# Altium project ADU.PrjPcb
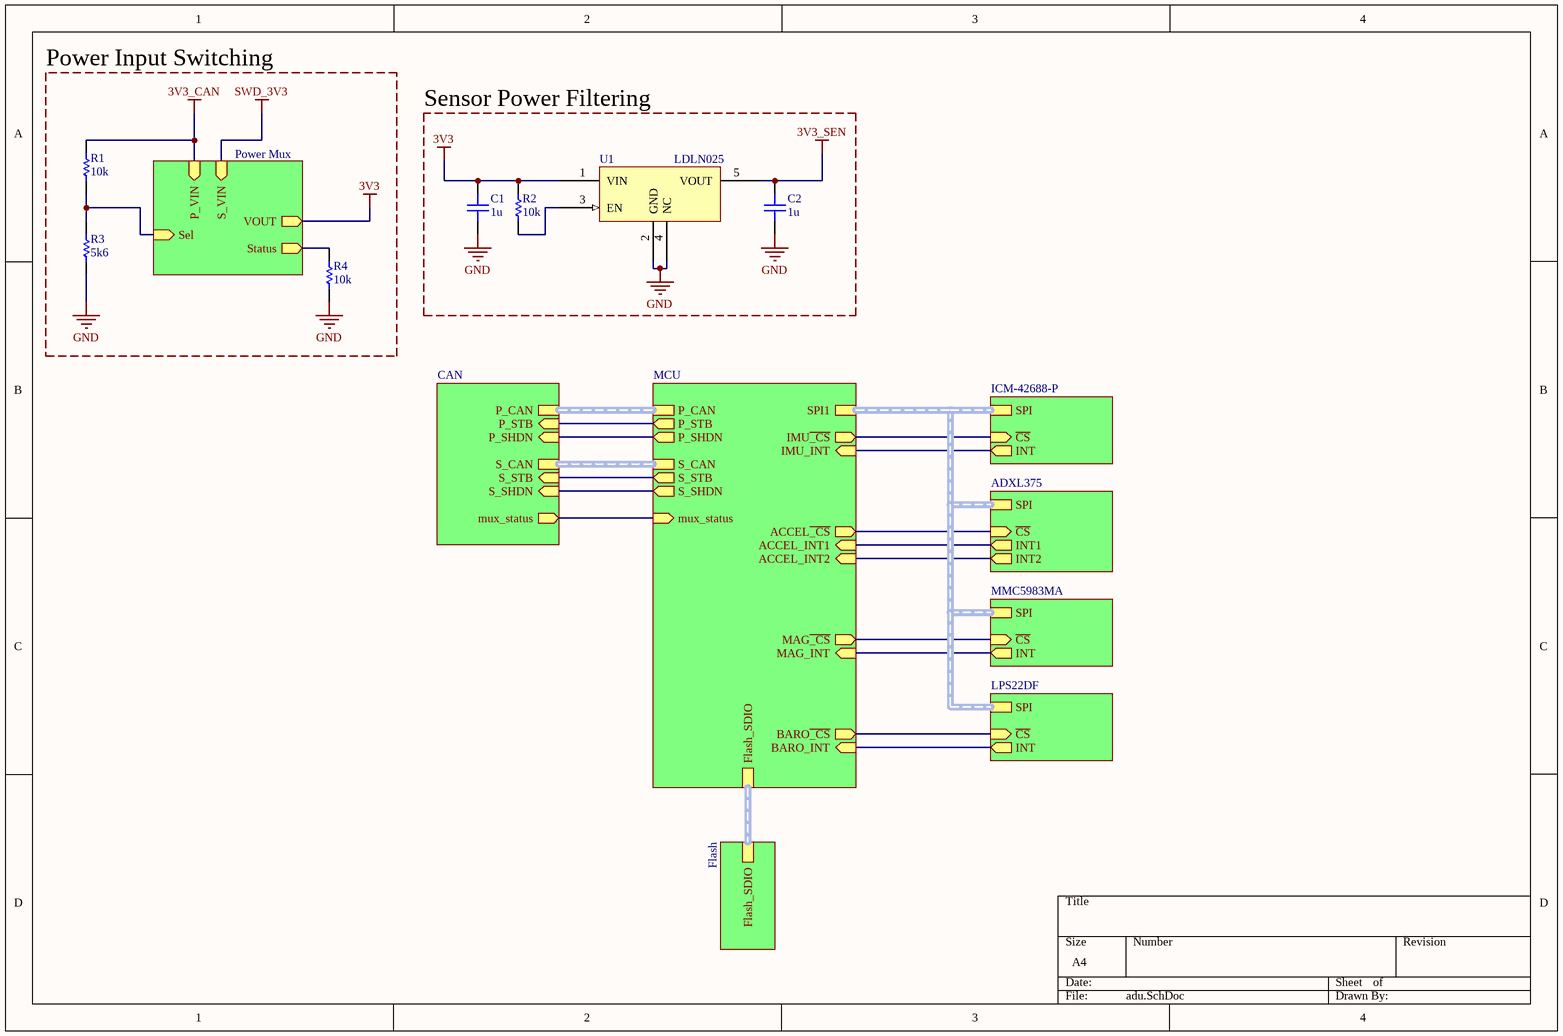
[diagram p0: adu.SchDoc]
11 sheets, 86 parts. Net scope: hierarchical (ports join the sheet entries above them; power ports are global).
Sheets:
  adu.SchDoc
    MCU = mcu.SchDoc
    CAN = CAN_bus_powered.SchDoc
      CAN Primary = CAN_transciever.SchDoc
      CAN Secondary = CAN_transciever.SchDoc
      Primary CAN Conn = dual_CAN_conn.SchDoc
      Secondary CAN Conn = dual_CAN_conn.SchDoc
      3V3_mux = power_mux.SchDoc
    Flash = flash.SchDoc
    ICM-42688-P = icm-42688-p.SchDoc
    ADXL375 = adxl375.SchDoc
    MMC5983MA = mmc5983ma.SchDoc
    LPS22DF = lps22df.SchDoc
    Power Mux = power_mux.SchDoc

## Sheet adu.SchDoc
size A4; SheetNumber: 1; SheetTotal: 11

### Parts
C1  1u  [CAP-0603-NP]
C2  1u  [CAP-0603-NP]
R1  10k  [RES-0603]
R2  10k  [RES-0603]
R3  5k6  [RES-0603]
R4  10k  [RES-0603]
U1  LDLN025  [ST SOT23-5L]

### Blocks framed on the sheet
Power Input Switching: R1 R3 R4
Sensor Power Filtering: C1 C2 R2 U1

### Sub-sheets
ADXL375 = adxl375: SPI (harness SPI), ~{CS} (in), INT1 (out), INT2 (out)
CAN = CAN_bus_powered: P_CAN (harness CAN), P_STB (in), P_SHDN (in), S_CAN (harness CAN), S_STB (in), S_SHDN (in), mux_status (out)
Flash = flash: Flash_SDIO (harness SDIO)
ICM-42688-P = icm-42688-p: SPI (harness SPI), ~{CS} (in), INT (out)
LPS22DF = lps22df: INT (out), SPI (harness SPI), ~{CS} (in)
MCU = mcu: Flash_SDIO (harness SDIO), SPI1 (harness SPI), mux_status (in), P_STB (out), P_SHDN (out), S_STB (out), S_SHDN (out), S_CAN (harness CAN), P_CAN (harness CAN), IMU~{_CS} (out), IMU_INT (in), ACCEL~{_CS} (out), ACCEL_INT2 (in), ACCEL_INT1 (in), MAG~{_CS} (out), MAG_INT (in), BARO~{_CS} (out), BARO_INT (in)
MMC5983MA = mmc5983ma: INT (out), SPI (harness SPI), ~{CS} (in)
Power Mux = power_mux: P_VIN (in), S_VIN (in), Sel (in), VOUT (out), Status (out)

### Nets
3V3: C1.2 R2.2 U1.1(VIN) ; sheet Power Mux/VOUT  [project net mux_out]
3V3_CAN: R1.2 ; sheet Power Mux/P_VIN  [project net mux_out]
3V3_SEN: C2.2 U1.5(VOUT)
GND: C1.1 C2.1 R3.1 R4.1 U1.2(GND) U1.4(NC)
mux_select: R1.1 R3.2 ; sheet Power Mux/Sel
mux_stat: R4.2 ; sheet Power Mux/Status
mux_stat: sheet MCU/mux_status, sheet CAN/mux_status  [a separate net that carries the same name]
P_CAN_SHDN: sheet MCU/P_SHDN, sheet CAN/P_SHDN
P_CAN_STB: sheet MCU/P_STB, sheet CAN/P_STB
S_CAN_SHDN: sheet MCU/S_SHDN, sheet CAN/S_SHDN
S_CAN_STB: sheet MCU/S_STB, sheet CAN/S_STB
NetR2_1: R2.1 U1.3(EN)
NetR20_1: sheet MCU/IMU~{_CS}, sheet ICM-42688-P/~{CS}
NetR21_1: sheet MCU/ACCEL~{_CS}, sheet ADXL375/~{CS}
NetR22_1: sheet MCU/MAG~{_CS}, sheet MMC5983MA/~{CS}
NetR23_1: sheet MCU/BARO~{_CS}, sheet LPS22DF/~{CS}
NetU3_17: sheet MCU/IMU_INT, sheet ICM-42688-P/INT
NetU3_24: sheet MCU/ACCEL_INT1, sheet ADXL375/INT1
NetU3_25: sheet MCU/ACCEL_INT2, sheet ADXL375/INT2
NetU3_28: sheet MCU/MAG_INT, sheet MMC5983MA/INT
NetU3_37: sheet MCU/BARO_INT, sheet LPS22DF/INT

### Buses and harness runs
harness sheet ADXL375/SPI = sheet ICM-42688-P/SPI = sheet LPS22DF/SPI = sheet MCU/SPI1 = sheet MMC5983MA/SPI
harness sheet CAN/P_CAN = sheet MCU/P_CAN
harness sheet CAN/S_CAN = sheet MCU/S_CAN
harness sheet Flash/Flash_SDIO = sheet MCU/Flash_SDIO

### Library data of the parts
C1 C2 = Capacitor
R1-R4 = Resistor
U1 = LDLN025: 250 mA ultra low noise LDO

## Sheet mcu.SchDoc
size A4; SheetNumber: 5; SheetTotal: 11
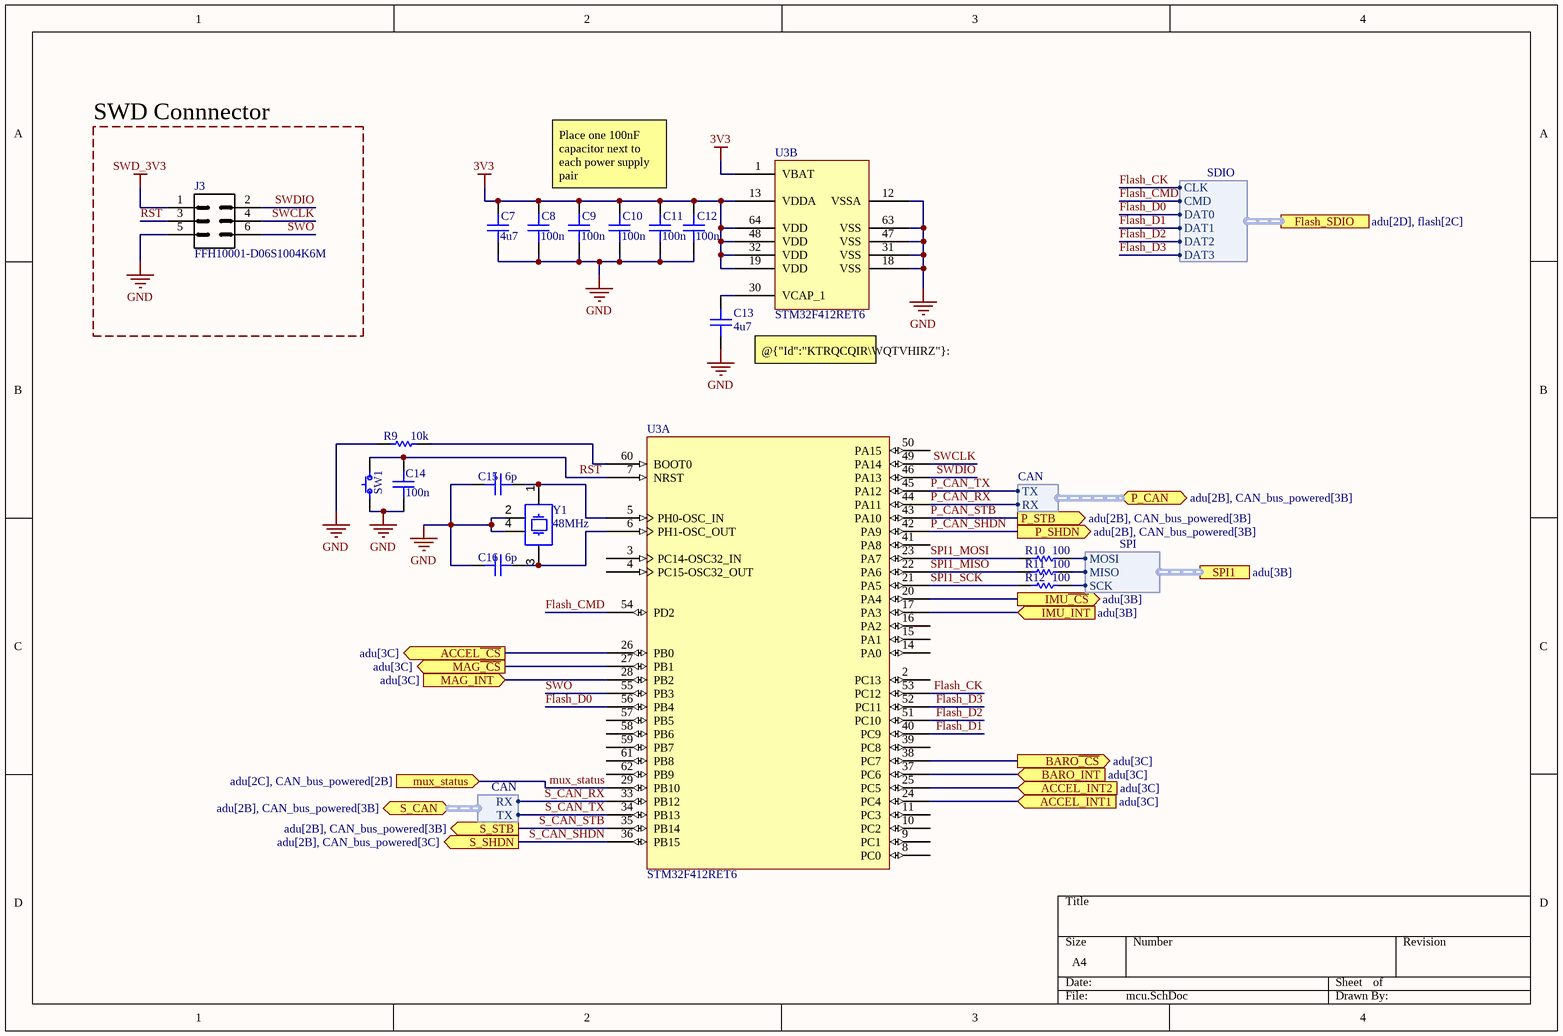
[diagram p1: mcu.SchDoc]

### Parts
C7  4u7  [CAP-0603-NP]
C8  100n  [CAP-0603-NP]
C9  100n  [CAP-0603-NP]
C10  100n  [CAP-0603-NP]
C11  100n  [CAP-0603-NP]
C12  100n  [CAP-0603-NP]
C13  4u7  [CAP-0603-NP]
C14  100n  [CAP-0603-NP]
C15  6p  [CAP-0603-NP]
C16  6p  [CAP-0603-NP]
J3  FFH10001-D06S1004K6M  [SOP127P600-8N]
R9  10k  [RES-0603]
R10  100  [RES-0603]
R11  100  [RES-0603]
R12  100  [RES-0603]
SW1  SPST Switch  [HYP 1TS026A-1000-0550-CT]  (value not drawn)
U3  STM32F412RET6  [STM32 LQFP64]  (parts A,B of 2)
Y1  48MHz  [XTAL_3.2x2.5mm]

### Blocks framed on the sheet
SWD Connnector: J3

### Ports
ACCEL_INT1 (in, see adu[3C]), ACCEL_INT2 (in, see adu[3C]), ACCEL~{_CS} (out, see adu[3C]), BARO_INT (in, see adu[3C]), BARO~{_CS} (out, see adu[3C]), Flash_SDIO (harness SDIO, see adu[2D], flash[2C]), IMU_INT (in, see adu[3B]), IMU~{_CS} (out, see adu[3B]), MAG_INT (in, see adu[3C]), MAG~{_CS} (out, see adu[3C]), mux_status (in, see adu[2C], CAN_bus_powered[2B]), P_CAN (bidir, harness CAN, see adu[2B], CAN_bus_powered[3B]), P_SHDN (out, see adu[2B], CAN_bus_powered[3B]), P_STB (out, see adu[2B], CAN_bus_powered[3B]), S_CAN (bidir, harness CAN, see adu[2B], CAN_bus_powered[3B]), S_SHDN (out, see adu[2B], CAN_bus_powered[3C]), S_STB (out, see adu[2B], CAN_bus_powered[3B]), SPI1 (harness SPI, see adu[3B])

### Harnesses
SDIO: CLK, CMD, DAT0, DAT1, DAT2, DAT3
SPI: MISO, SCK, MOSI
CAN: TX, RX

### Nets
3V3: C7.2 C8.2 C9.2 C10.2 C11.2 C12.2 U3.1(VBAT) U3.13(VDDA) U3.19(VDD) U3.32(VDD) U3.48(VDD) U3.64(VDD)  [project net mux_out]
GND: C7.1 C8.1 C9.1 C10.1 C11.1 C12.1 C13.1 C14.1 C15.1 C16.1 J3.5 R9.1 SW1.1 U3.12(VSSA) U3.18(VSS) U3.31(VSS) U3.47(VSS) U3.63(VSS) Y1.2(GND) Y1.4(GND)
SWD_3V3: J3.1  [project net secondary_VIN]
Flash_CK: U3.53(PC12) ; port Flash_SDIO.CLK
Flash_CMD: U3.54(PD2) ; port Flash_SDIO.CMD
Flash_D0: U3.56(PB4) ; port Flash_SDIO.DAT0
Flash_D1: U3.40(PC9) ; port Flash_SDIO.DAT1
Flash_D2: U3.51(PC10) ; port Flash_SDIO.DAT2
Flash_D3: U3.52(PC11) ; port Flash_SDIO.DAT3
mux_status: U3.29(PB10) ; port mux_status  [project net mux_stat]
P_CAN_RX: U3.44(PA11) ; port P_CAN.RX
P_CAN_SHDN: U3.42(PA9) ; port P_SHDN
P_CAN_STB: U3.43(PA10) ; port P_STB
P_CAN_TX: U3.45(PA12) ; port P_CAN.TX
RST: C14.2 J3.3 SW1.2 U3.7(NRST)
S_CAN_RX: U3.33(PB12) ; port S_CAN.RX
S_CAN_SHDN: U3.36(PB15) ; port S_SHDN
S_CAN_STB: U3.35(PB14) ; port S_STB
S_CAN_TX: U3.34(PB13) ; port S_CAN.TX
SPI1_MISO: R11.2 U3.22(PA6)
SPI1_MOSI: R10.2 U3.23(PA7)
SPI1_SCK: R12.2 U3.21(PA5)
SWCLK: J3.4 U3.49(PA14)
SWDIO: J3.2 U3.46(PA13)
SWO: J3.6 U3.55(PB3)
NetC13_2: C13.2 U3.30(VCAP_1)
NetC15_2: C15.2 U3.5(PH0-OSC_IN) Y1.1(X1)
NetC16_2: C16.2 U3.6(PH1-OSC_OUT) Y1.3(X2)
NetR9_2: R9.2 U3.60(BOOT0)
NetR10_1: R10.1 ; port SPI1.MOSI
NetR11_1: R11.1 ; port SPI1.MISO
NetR12_1: R12.1 ; port SPI1.SCK
NetR20_1: U3.20(PA4) ; port IMU~{_CS}
NetR21_1: U3.26(PB0) ; port ACCEL~{_CS}
NetR22_1: U3.27(PB1) ; port MAG~{_CS}
NetR23_1: U3.38(PC7) ; port BARO~{_CS}
NetU3_17: U3.17(PA3) ; port IMU_INT
NetU3_24: U3.24(PC4) ; port ACCEL_INT1
NetU3_25: U3.25(PC5) ; port ACCEL_INT2
NetU3_28: U3.28(PB2) ; port MAG_INT
NetU3_37: U3.37(PC6) ; port BARO_INT

Not connected (* = marked no-connect by the designer): U3 2(PC13) 3(PC14-OSC32_IN) 4(PC15-OSC32_OUT) 8(PC0) 9(PC1) 10(PC2) 11(PC3) 14(PA0) 15(PA1) 16(PA2) 39(PC8) 41(PA8) 50(PA15) 57(PB5) 58(PB6) 59(PB7) 61(PB8) 62(PB9)

### Notes on the sheet
- Place one 100nF capacitor next to each power supply pair
- @{"Id":"KTRQCQIR\WQTVHIRZ"}: ESR < 1 Ohm

### Library data of the parts
C7-C16 = Capacitor
J3 = Connector 6-Pin 2 Row
R9-R12 = Resistor
SW1 = SW_SPST: HYP (Hongyuan Precision) 1TS026A-1000-0550-CT
U3 = STM32F412RET6: 512KB 1.7V~3.6V ARM Cortex-M4 256KB 100MHz FLASH 50 LQFP-64(10x10) Microcontroller Units (MCUs/MPUs/SOCs) ROHS
Y1 = XTAL-4Pin: HCI XC32M4-48.000-F08NLDT / 8pF load capacitance

## Sheet CAN_bus_powered.SchDoc
size A4; SheetNumber: 2; SheetTotal: 11
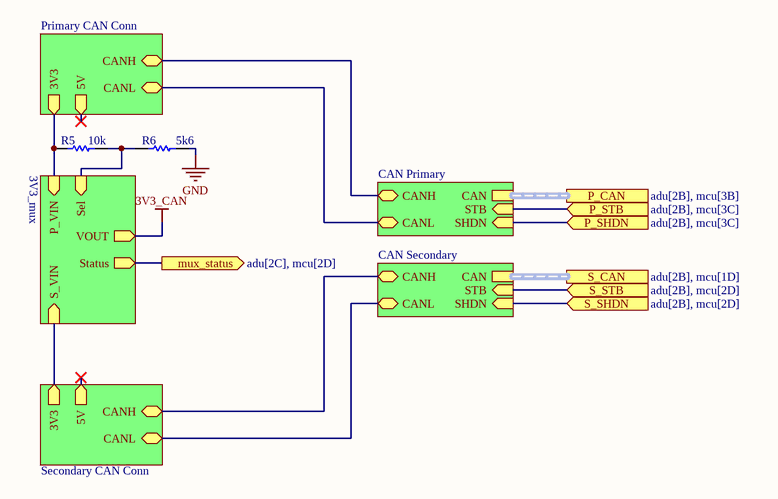
[diagram p2: CAN_bus_powered.SchDoc]

### Parts
R5  10k  [RES-0603]
R6  5k6  [RES-0603]

### Sub-sheets
3V3_mux = power_mux: P_VIN (in), S_VIN (in), Sel (in), VOUT (out), Status (out)
CAN Primary = CAN_transciever: CAN (harness CAN), STB (in), SHDN (in), CANH (bidir), CANL (bidir)
CAN Secondary = CAN_transciever: CAN (harness CAN), STB (in), SHDN (in), CANH (bidir), CANL (bidir)
Primary CAN Conn = dual_CAN_conn: 5V (out), 3V3 (out), CANH (bidir), CANL (bidir)
Secondary CAN Conn = dual_CAN_conn: 5V (out), 3V3 (out), CANH (bidir), CANL (bidir)

### Ports
mux_status (out, see adu[2C], mcu[2D]), P_CAN (harness CAN, see adu[2B], mcu[3B]), P_SHDN (in, see adu[2B], mcu[3C]), P_STB (in, see adu[2B], mcu[3C]), S_CAN (harness CAN, see adu[2B], mcu[1D]), S_SHDN (in, see adu[2B], mcu[2D]), S_STB (in, see adu[2B], mcu[2D])

### Nets
GND: R6.1
CAN_N: sheet CAN Primary/CANL, sheet Primary CAN Conn/CANL
CAN_N: sheet CAN Secondary/CANL, sheet Secondary CAN Conn/CANL  [a separate net that carries the same name]
CAN_P: sheet CAN Primary/CANH, sheet Primary CAN Conn/CANH
CAN_P: sheet CAN Secondary/CANH, sheet Secondary CAN Conn/CANH  [a separate net that carries the same name]
mux_select: R5.1 R6.2 ; sheet 3V3_mux/Sel
mux_stat: port mux_status, sheet 3V3_mux/Status
P_CAN_SHDN: port P_SHDN, sheet CAN Primary/SHDN
P_CAN_STB: port P_STB, sheet CAN Primary/STB
primary_VIN: R5.2 ; sheet Primary CAN Conn/3V3, sheet 3V3_mux/P_VIN
S_CAN_SHDN: port S_SHDN, sheet CAN Secondary/SHDN
S_CAN_STB: port S_STB, sheet CAN Secondary/STB
secondary_VIN: sheet Secondary CAN Conn/3V3, sheet 3V3_mux/S_VIN

### Buses and harness runs
harness port P_CAN = sheet CAN Primary/CAN
harness port S_CAN = sheet CAN Secondary/CAN

### Library data of the parts
R5 R6 = Resistor

## Sheet CAN_transciever.SchDoc
size A4; SheetNumber: 3; SheetTotal: 11
Used 2 times, as channels CAN/CAN Primary, CAN/CAN Secondary. Parts and nets are listed once, with the designators drawn on the sheet.
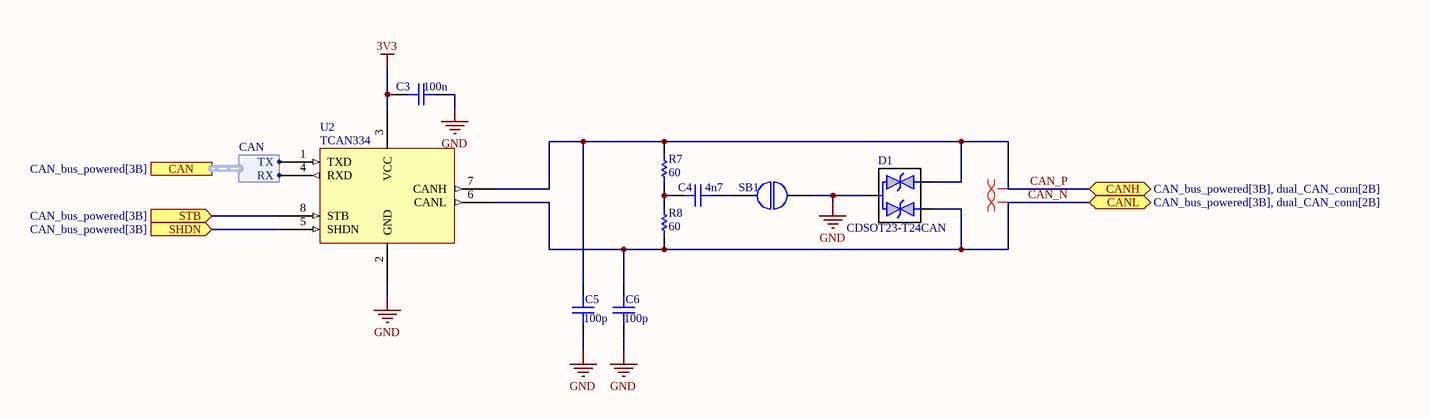
[diagram p3: CAN_transciever.SchDoc]

### Parts
C3  100n  [CAP-0603-NP]
C4  4n7  [CAP-0603-NP]
C5  100p  [CAP-0603-NP]
C6  100p  [CAP-0603-NP]
D1  CDSOT23-T24CAN  [SOT23127P600-8N]
R7  60  [RES-0603]
R8  60  [RES-0603]
SB1  NO Solder Bridge  [Solder Bridge]  (value not drawn)
U2  TCAN334  [ST SOT23-5L]

### Ports
CAN (harness CAN, see CAN_bus_powered[3B]), CANH (bidir, see CAN_bus_powered[3B], dual_CAN_conn[2B]), CANL (bidir, see CAN_bus_powered[3B], dual_CAN_conn[2B]), SHDN (in, see CAN_bus_powered[3B]), STB (in, see CAN_bus_powered[3B])

### Harnesses
CAN: TX, RX

### Nets
3V3: C3.2 U2.3(VCC)
GND: C3.1 C5.2 C6.2 D1.3 SB1.1 U2.2(GND)
CAN_N: C6.1 D1.1 R8.2 U2.6(CANL) ; port CANL
CAN_P: C5.1 D1.2 R7.1 U2.7(CANH) ; port CANH
SHDN: U2.5(SHDN) ; port SHDN
STB: U2.8(STB) ; port STB
NetC4_1: C4.1 SB1.2
NetC4_2: C4.2 R7.2 R8.1
NetU2_1: U2.1(TXD) ; port CAN.TX
NetU2_4: U2.4(RXD) ; port CAN.RX

### Channels
CAN/CAN Primary: designators end in _CAN_Primary; ports CANH=CAN_P CANL=CAN_N SHDN=P_CAN_SHDN STB=P_CAN_STB
CAN/CAN Secondary: designators end in _CAN_Secondary; ports CANH=CAN_P CANL=CAN_N SHDN=S_CAN_SHDN STB=S_CAN_STB

### Layout directives
differential pair: CAN_N, CAN_P

### Library data of the parts
C3-C6 = Capacitor
D1 = Dual TVS Diode
R7 R8 = Resistor
SB1 = NO Solder Bridge: Normally Open Solder Bridge
U2 = TCAN334: Can tranciever with shutdown and standby with wake

## Sheet dual_CAN_conn.SchDoc
size A4; SheetNumber: 4; SheetTotal: 11
Used 2 times, as channels CAN/Primary CAN Conn, CAN/Secondary CAN Conn. Parts and nets are listed once, with the designators drawn on the sheet.
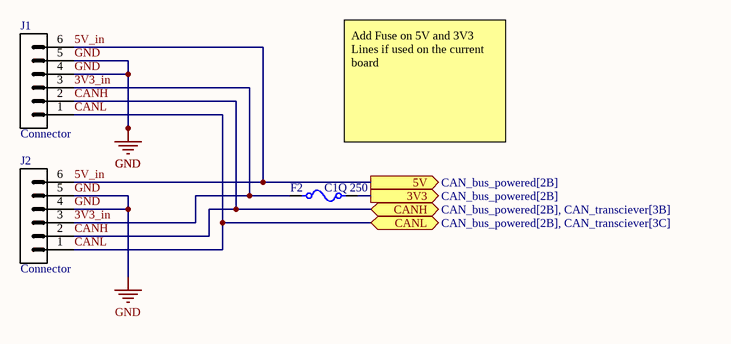
[diagram p4: dual_CAN_conn.SchDoc]

### Parts
F2  C1Q 250  [Chip2PinSM127P600-8N]
J1  Connector  [HRS_DF58-6P-1.2V(21)]
J2  Connector  [HRS_DF58-6P-1.2V(21)]

### Ports
3V3 (out, see CAN_bus_powered[2B]), 5V (out, see CAN_bus_powered[2B]), CANH (bidir, see CAN_bus_powered[2B], CAN_transciever[3B]), CANL (bidir, see CAN_bus_powered[2B], CAN_transciever[3C])

### Nets
GND: J1.4 J1.5 J2.4 J2.5
3V3: F2.2 ; port 3V3
3V3_in: F2.1 J1.3 J2.3
5V_in: J1.6 J2.6 ; port 5V
CANH: J1.2 J2.2 ; port CANH
CANL: J1.1 J2.1 ; port CANL

### Channels
CAN/Primary CAN Conn: designators end in _Primary_CAN_Conn; ports 3V3=primary_VIN 5V=5V_in_Primary CAN Conn CANH=CAN_P CANL=CAN_N
CAN/Secondary CAN Conn: designators end in _Secondary_CAN_Conn; ports 3V3=secondary_VIN 5V=5V_in_Secondary CAN Conn CANH=CAN_P CANL=CAN_N

### Notes on the sheet
- Add Fuse on 5V and 3V3 Lines if used on the current board

### Library data of the parts
F2 = Fuse
J1 J2 = Connector 6-Pin 1 Row: 6 Pin 1 Row Connector

## Sheet power_mux.SchDoc
size A4; SheetNumber: 6; SheetTotal: 11
Used 2 times, as channels CAN/3V3_mux, Power Mux. Parts and nets are listed once, with the designators drawn on the sheet.
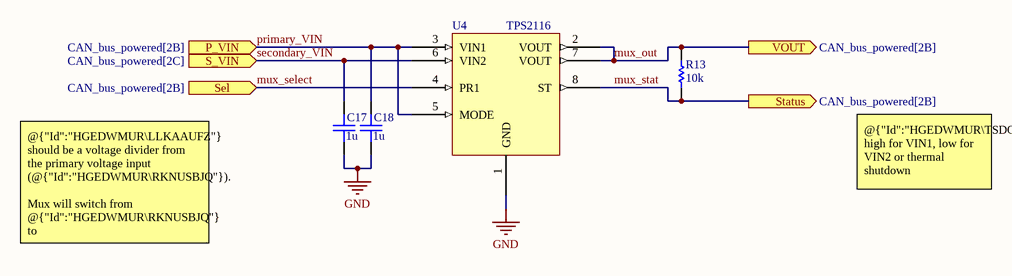
[diagram p5: power_mux.SchDoc]

### Parts
C17  1u  [CAP-0603-NP]
C18  1u  [CAP-0603-NP]
R13  10k  [RES-0603]
U4  TPS2116  [SOT-5x3]

### Ports
P_VIN (in, see CAN_bus_powered[2B]), S_VIN (in, see CAN_bus_powered[2C]), Sel (in, see CAN_bus_powered[2B]), Status (out, see CAN_bus_powered[2B]), VOUT (out, see CAN_bus_powered[2B])

### Nets
GND: C17.1 C18.1 U4.1(GND)
mux_out: R13.2 U4.2(VOUT) U4.7(VOUT) ; port VOUT
mux_select: U4.4(PR1) ; port Sel
mux_stat: R13.1 U4.8(ST) ; port Status
primary_VIN: C18.2 U4.3(VIN1) U4.5(MODE) ; port P_VIN
secondary_VIN: C17.2 U4.6(VIN2) ; port S_VIN

### Channels
CAN/3V3_mux: designators end in _3V3_mux; ports P_VIN=primary_VIN S_VIN=secondary_VIN Sel=mux_select Status=mux_stat VOUT=mux_out
Power Mux: designators end in _Power_Mux; ports P_VIN=mux_out S_VIN=secondary_VIN Sel=mux_select Status=mux_stat VOUT=mux_out

### Notes on the sheet
- @{"Id":"HGEDWMUR\TSDOJRFR"}: high for VIN1, low for VIN2 or thermal shutdown
- @{"Id":"HGEDWMUR\LLKAAUFZ"} should be a voltage divider from the primary voltage input (@{"Id":"HGEDWMUR\RKNUSBJQ"}).
  Mux will switch from @{"Id":"HGEDWMUR\RKNUSBJQ"} to @{"Id":"HGEDWMUR\STDIKBVV"} when the voltage at sel is less than 1V.

### Library data of the parts
C17 C18 = Capacitor
R13 = Resistor
U4 = TPS2116: 1.6 V to 5.5 V, 2.5-A Low IQ Power Mux with Manual and Priority Switchover

## Sheet flash.SchDoc
size A4; SheetNumber: 7; SheetTotal: 11
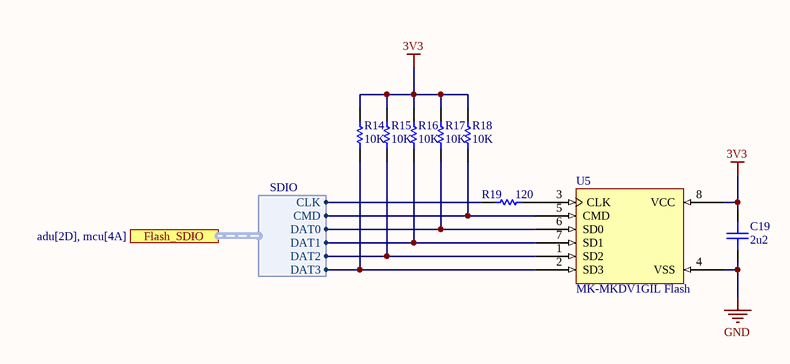
[diagram p6: flash.SchDoc]

### Parts
C19  2u2  [CAP-0603-NP]
R14  10K  [RES-0603]
R15  10K  [RES-0603]
R16  10K  [RES-0603]
R17  10K  [RES-0603]
R18  10K  [RES-0603]
R19  120  [RES-0603]
U5  MK-MKDV1GIL Flash  [QFN127P800X600X75-8N]

### Ports
Flash_SDIO (harness SDIO, see adu[2D], mcu[4A])

### Harnesses
SDIO: CLK, CMD, DAT0, DAT1, DAT2, DAT3

### Nets
3V3: C19.2 R14.2 R15.2 R16.2 R17.2 R18.2 U5.8(VCC)  [project net mux_out]
GND: C19.1 U5.4(VSS)
Flash_CK: R19.2 ; port Flash_SDIO.CLK
Flash_CMD: R18.1 U5.5(CMD) ; port Flash_SDIO.CMD
Flash_D0: R17.1 U5.6(SD0) ; port Flash_SDIO.DAT0
Flash_D1: R16.1 U5.7(SD1) ; port Flash_SDIO.DAT1
Flash_D2: R15.1 U5.1(SD2) ; port Flash_SDIO.DAT2
Flash_D3: R14.1 U5.2(SD3) ; port Flash_SDIO.DAT3
NetR19_1: R19.1 U5.3(CLK)

### Library data of the parts
C19 = Capacitor
R14-R19 = Resistor
U5 = MK-MKDV1GIL: 1Gbit LGA-8(6x8) SD NAND FLASH ROHS

## Sheet icm-42688-p.SchDoc
size A4; SheetNumber: 8; SheetTotal: 11
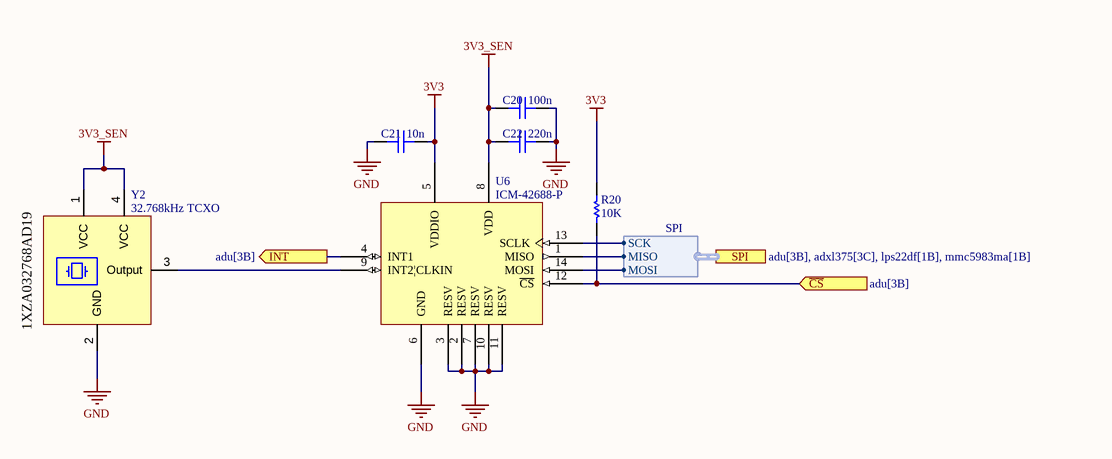
[diagram p7: icm-42688-p.SchDoc]

### Parts
C20  100n  [CAP-0603-NP]
C21  10n  [CAP-0603-NP]
C22  220n  [CAP-0603-NP]
R20  10K  [RES-0603]
U6  ICM-42688-P  [ICM-42688-P]
Y2  32.768kHz TCXO  [DSK321STD]

### Ports
INT (out, see adu[3B]), SPI (harness SPI, see adu[3B], adxl375[3C], lps22df[1B], mmc5983ma[1B]), ~{CS} (in, see adu[3B])

### Harnesses
SPI: MISO, MOSI, SCK

### Nets
3V3: C21.2 R20.2 U6.5(VDDIO)  [project net mux_out]
3V3_SEN: C20.1 C22.1 U6.8(VDD) Y2.1(VCC) Y2.4(VCC)
GND: C20.2 C21.1 C22.2 U6.2(RESV) U6.3(RESV) U6.6(GND) U6.7(RESV) U6.10(RESV) U6.11(RESV) Y2.2(GND)
NetR10_1: U6.14(MOSI) ; port SPI.MOSI
NetR11_1: U6.1(MISO) ; port SPI.MISO
NetR12_1: U6.13(SCLK) ; port SPI.SCK
NetR20_1: R20.1 U6.12(~{CS}) ; port ~{CS}
NetU3_17: U6.4(INT1) ; port INT
NetU6_9: U6.9(INT2|CLKIN) Y2.3(Output)

### Notes on the sheet
- (near Y2) 1XZA032768AD19

### Library data of the parts
C20-C22 = Capacitor
R20 = Resistor
U6 = ICM-42688-P: High Precision 6-Axis MEMS Gyro and Accelerometer
Y2 = TCXO-4Pin: 3.3V ±5ppm 32.768kHz SMD3225-4P Temperature Compensated Crystal Oscillators (TCXOs) ROHS

## Sheet adxl375.SchDoc
size A4; SheetNumber: 9; SheetTotal: 11
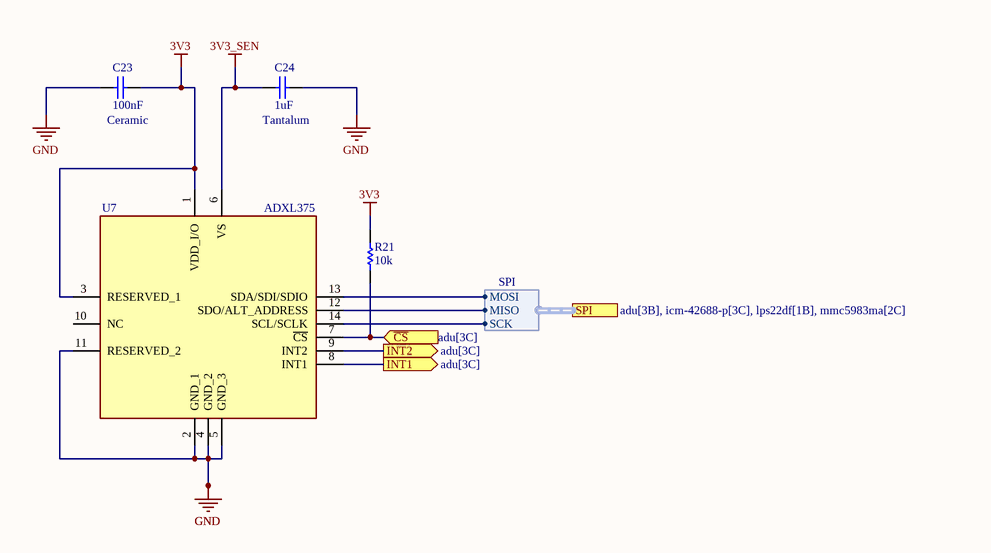
[diagram p8: adxl375.SchDoc]

### Parts
C23  value 100nF  [CAPC0603X33N]  (hidden comment: Cap)
C24  value 1uF  [CAPC0603X33N]  (hidden comment: Cap)
R21  10k  [RES-0603]
U7  ADXL375  [ADXL375]

### Ports
INT1 (out, see adu[3C]), INT2 (out, see adu[3C]), SPI (harness SPI, see adu[3B], icm-42688-p[3C], lps22df[1B], mmc5983ma[2C]), ~{CS} (in, see adu[3C])

### Harnesses
SPI: MISO, MOSI, SCK

### Nets
3V3: C23.1 R21.2 U7.1(VDD_I/O) U7.3(RESERVED_1)  [project net mux_out]
3V3_SEN: C24.2 U7.6(VS)
GND: C23.2 C24.1 U7.2(GND_1) U7.4(GND_2) U7.5(GND_3) U7.11(RESERVED_2)
NetR10_1: U7.13(SDA/SDI/SDIO) ; port SPI.MOSI
NetR11_1: U7.12(SDO/ALT_ADDRESS) ; port SPI.MISO
NetR12_1: U7.14(SCL/SCLK) ; port SPI.SCK
NetR21_1: R21.1 U7.7(~{CS}) ; port ~{CS}
NetU3_24: U7.8(INT1) ; port INT1
NetU3_25: U7.9(INT2) ; port INT2

Not connected (* = marked no-connect by the designer): U7 10(NC)

### Notes on the sheet
- (near C23) Ceramic
- (near C24) Tantalum

### Library data of the parts
C23 C24 = Cap: Capacitor; Published: 8-Jun-2000; LatestRevisionDate: 17-Jul-2002; LatestRevisionNote: Re-released for DXP Platform.; PackageReference: RAD-0.3; Publisher: Altium Limited; PackageDescription: Radial Cap, Thru-Hole; 2 Leads; 0.3 in Pin Spacing
  C24: Supplier 1: Rs; Supplier Part Number 1: 1362639
R21 = Resistor
U7 = ADXL375: 3-Axis, ±200 g / Digital MEMS Accelerometer

## Sheet mmc5983ma.SchDoc
size A4; SheetNumber: 10; SheetTotal: 11
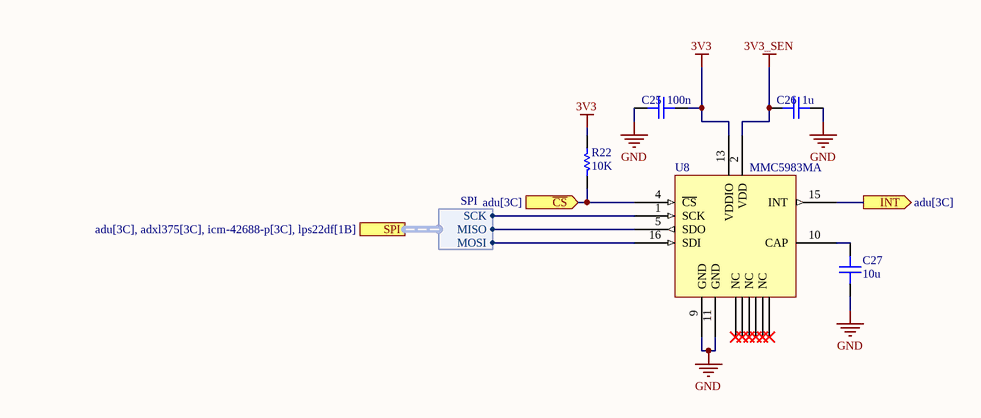
[diagram p9: mmc5983ma.SchDoc]

### Parts
C25  100n  [CAP-0603-NP]
C26  1u  [CAP-0603-NP]
C27  10u  [CAP-0603-NP]
R22  10K  [RES-0603]
U8  MMC5983MA  [MMC5983MA]

### Ports
INT (out, see adu[3C]), SPI (harness SPI, see adu[3C], adxl375[3C], icm-42688-p[3C], lps22df[1B]), ~{CS} (in, see adu[3C])

### Harnesses
SPI: MISO, MOSI, SCK

### Nets
3V3: C25.2 R22.2 U8.13(VDDIO)  [project net mux_out]
3V3_SEN: C26.1 U8.2(VDD)
GND: C25.1 C26.2 C27.1 U8.9(GND) U8.11(GND)
NetC27_2: C27.2 U8.10(CAP)
NetR10_1: U8.16(SDI) ; port SPI.MOSI
NetR11_1: U8.5(SDO) ; port SPI.MISO
NetR12_1: U8.1(SCK) ; port SPI.SCK
NetR22_1: R22.1 U8.4(~{CS}) ; port ~{CS}
NetU3_28: U8.15(INT) ; port INT

Not connected (* = marked no-connect by the designer): U8 3(NC)* 6(NC)* 7(NC)* 8(NC)* 12(NC)* 14(NC)*

### Library data of the parts
C25-C27 = Capacitor
R22 = Resistor
U8 = MMC5983MA: ±8 Gauss, High Performance / 3-axis Magnetic Sensor

## Sheet lps22df.SchDoc
size A4; SheetNumber: 11; SheetTotal: 11
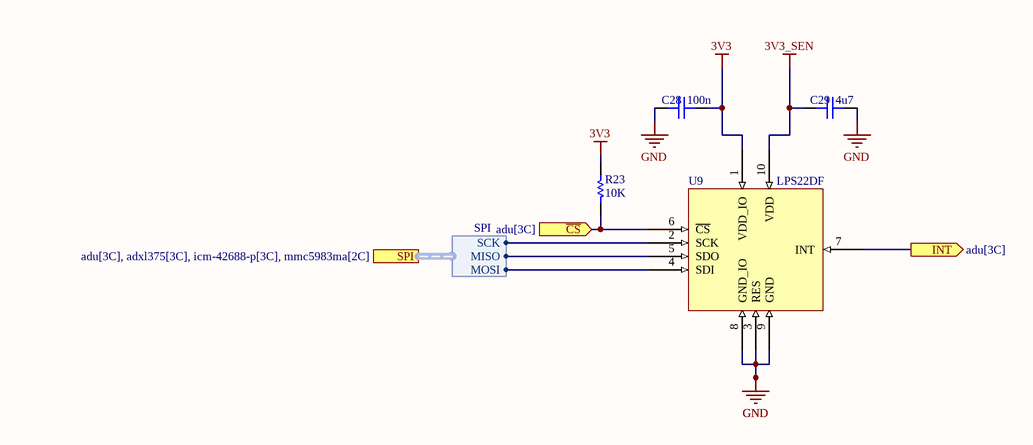
[diagram p10: lps22df.SchDoc]

### Parts
C28  100n  [CAP-0603-NP]
C29  4u7  [CAP-0603-NP]
R23  10K  [RES-0603]
U9  LPS22DF  [LPS22DF]

### Ports
INT (out, see adu[3C]), SPI (harness SPI, see adu[3C], adxl375[3C], icm-42688-p[3C], mmc5983ma[2C]), ~{CS} (in, see adu[3C])

### Harnesses
SPI: MISO, MOSI, SCK

### Nets
3V3: C28.2 R23.2 U9.1(VDD_IO)  [project net mux_out]
3V3_SEN: C29.1 U9.10(VDD)
GND: C28.1 C29.2 U9.3(RES) U9.8(GND_IO) U9.9(GND)
NetR10_1: U9.4(SDI) ; port SPI.MOSI
NetR11_1: U9.5(SDO) ; port SPI.MISO
NetR12_1: U9.2(SCK) ; port SPI.SCK
NetR23_1: R23.1 U9.6(~{CS}) ; port ~{CS}
NetU3_37: U9.7(INT) ; port INT

### Library data of the parts
C28 C29 = Capacitor
R23 = Resistor
U9 = LPS22DF: Low-power and high-precision MEMS nano pressure sensor: 260-1260 hPa absolute digital output barometer

## Nets that join several sheets
3V3_SEN: adu (C2.2 U1.5), icm-42688-p (5 pins), adxl375 (C24.2 U7.6), mmc5983ma (C26.1 U8.2), lps22df (C29.1 U9.10)
GND: adu (6 pins), mcu (20 pins), CAN_bus_powered (R6.1), CAN/CAN Primary (6 pins), CAN/CAN Secondary (6 pins), CAN/Primary CAN Conn (J1_Primary_CAN_Conn.4 J1_Primary_CAN_Conn.5 J2_Primary_CAN_Conn.4 J2_Primary_CAN_Conn.5), CAN/Secondary CAN Conn (J1_Secondary_CAN_Conn.4 J1_Secondary_CAN_Conn.5 J2_Secondary_CAN_Conn.4 J2_Secondary_CAN_Conn.5), CAN/3V3_mux (C17_3V3_mux.1 C18_3V3_mux.1 U4_3V3_mux.1), flash (C19.1 U5.4), icm-42688-p (10 pins), adxl375 (6 pins), mmc5983ma (5 pins), lps22df (5 pins), Power Mux (C17_Power_Mux.1 C18_Power_Mux.1 U4_Power_Mux.1)
mux_out: adu (C1.2 R2.2 U1.1), mcu (12 pins), CAN/CAN Primary (C3_CAN_Primary.2 U2_CAN_Primary.3), CAN/CAN Secondary (C3_CAN_Secondary.2 U2_CAN_Secondary.3), flash (7 pins), icm-42688-p (C21.2 R20.2 U6.5), adxl375 (C23.1 R21.2 U7.1 U7.3), mmc5983ma (C25.2 R22.2 U8.13), lps22df (C28.2 R23.2 U9.1), Power Mux (R13_Power_Mux.2 U4_Power_Mux.2 U4_Power_Mux.7)
mux_out: adu (R1.2), CAN/3V3_mux (R13_3V3_mux.2 U4_3V3_mux.2 U4_3V3_mux.7), Power Mux (C18_Power_Mux.2 U4_Power_Mux.3 U4_Power_Mux.5)
secondary_VIN: mcu (J3.1), Power Mux (C17_Power_Mux.2 U4_Power_Mux.6)
CAN_N: CAN/CAN Primary (C6_CAN_Primary.1 D1_CAN_Primary.1 R8_CAN_Primary.2 U2_CAN_Primary.6), CAN/Primary CAN Conn (J1_Primary_CAN_Conn.1 J2_Primary_CAN_Conn.1)
CAN_N: CAN/CAN Secondary (C6_CAN_Secondary.1 D1_CAN_Secondary.1 R8_CAN_Secondary.2 U2_CAN_Secondary.6), CAN/Secondary CAN Conn (J1_Secondary_CAN_Conn.1 J2_Secondary_CAN_Conn.1)
CAN_P: CAN/CAN Primary (C5_CAN_Primary.1 D1_CAN_Primary.2 R7_CAN_Primary.1 U2_CAN_Primary.7), CAN/Primary CAN Conn (J1_Primary_CAN_Conn.2 J2_Primary_CAN_Conn.2)
CAN_P: CAN/CAN Secondary (C5_CAN_Secondary.1 D1_CAN_Secondary.2 R7_CAN_Secondary.1 U2_CAN_Secondary.7), CAN/Secondary CAN Conn (J1_Secondary_CAN_Conn.2 J2_Secondary_CAN_Conn.2)
Flash_CK: mcu (U3.53), flash (R19.2)
Flash_CMD: mcu (U3.54), flash (R18.1 U5.5)
Flash_D0: mcu (U3.56), flash (R17.1 U5.6)
Flash_D1: mcu (U3.40), flash (R16.1 U5.7)
Flash_D2: mcu (U3.51), flash (R15.1 U5.1)
Flash_D3: mcu (U3.52), flash (R14.1 U5.2)
mux_select: adu (R1.1 R3.2), Power Mux (U4_Power_Mux.4)
mux_select: CAN_bus_powered (R5.1 R6.2), CAN/3V3_mux (U4_3V3_mux.4)
mux_stat: adu (R4.2), Power Mux (R13_Power_Mux.1 U4_Power_Mux.8)
mux_stat: mcu (U3.29), CAN/3V3_mux (R13_3V3_mux.1 U4_3V3_mux.8)
NetR10_1: mcu (R10.1), icm-42688-p (U6.14), adxl375 (U7.13), mmc5983ma (U8.16), lps22df (U9.4)
NetR11_1: mcu (R11.1), icm-42688-p (U6.1), adxl375 (U7.12), mmc5983ma (U8.5), lps22df (U9.5)
NetR12_1: mcu (R12.1), icm-42688-p (U6.13), adxl375 (U7.14), mmc5983ma (U8.1), lps22df (U9.2)
NetR20_1: mcu (U3.20), icm-42688-p (R20.1 U6.12)
NetR21_1: mcu (U3.26), adxl375 (R21.1 U7.7)
NetR22_1: mcu (U3.27), mmc5983ma (R22.1 U8.4)
NetR23_1: mcu (U3.38), lps22df (R23.1 U9.6)
NetU3_17: mcu (U3.17), icm-42688-p (U6.4)
NetU3_24: mcu (U3.24), adxl375 (U7.8)
NetU3_25: mcu (U3.25), adxl375 (U7.9)
NetU3_28: mcu (U3.28), mmc5983ma (U8.15)
NetU3_37: mcu (U3.37), lps22df (U9.7)
P_CAN_RX: mcu (U3.44), CAN/CAN Primary (U2_CAN_Primary.4)
P_CAN_SHDN: mcu (U3.42), CAN/CAN Primary (U2_CAN_Primary.5)
P_CAN_STB: mcu (U3.43), CAN/CAN Primary (U2_CAN_Primary.8)
P_CAN_TX: mcu (U3.45), CAN/CAN Primary (U2_CAN_Primary.1)
primary_VIN: CAN_bus_powered (R5.2), CAN/Primary CAN Conn (F2_Primary_CAN_Conn.2), CAN/3V3_mux (C18_3V3_mux.2 U4_3V3_mux.3 U4_3V3_mux.5)
S_CAN_RX: mcu (U3.33), CAN/CAN Secondary (U2_CAN_Secondary.4)
S_CAN_SHDN: mcu (U3.36), CAN/CAN Secondary (U2_CAN_Secondary.5)
S_CAN_STB: mcu (U3.35), CAN/CAN Secondary (U2_CAN_Secondary.8)
S_CAN_TX: mcu (U3.34), CAN/CAN Secondary (U2_CAN_Secondary.1)
secondary_VIN: CAN/Secondary CAN Conn (F2_Secondary_CAN_Conn.2), CAN/3V3_mux (C17_3V3_mux.2 U4_3V3_mux.6)